# Altium schematic sheet OSPLC2_2_CPU2.SchDoc
size 294 x 198 mm
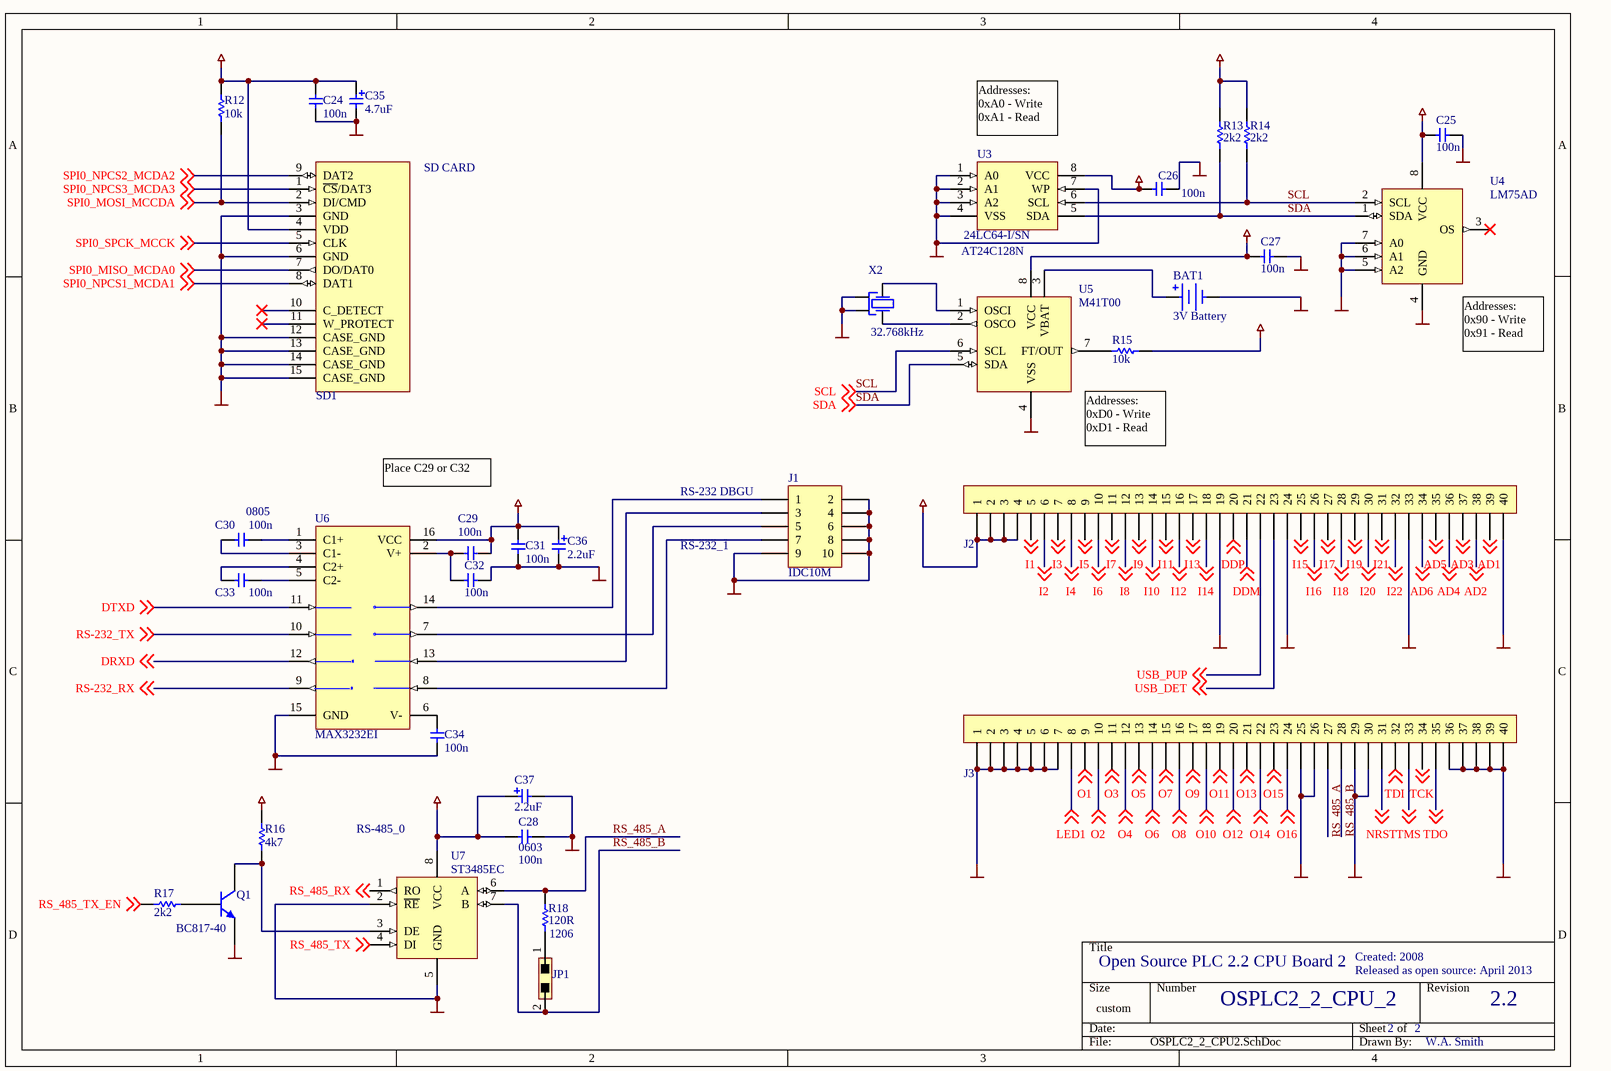
[diagram p0: OSPLC2_2_CPU2.SchDoc]

## Parts
BAT1  3V Battery  [BATTERY_22MM]
C24  value 100n  [0603]  (hidden comment: 0603)
C25  value 100n  [0603]  (hidden comment: 0603)
C26  value 100n  [0603]  (hidden comment: 0603)
C27  value 100n  [0603]  (hidden comment: 0603)
C28  0603  value 100n  [0603]
C29  value 100n  [0805]  (hidden comment: 0805)
C30  0805  value 100n  [0805]
C31  value 100n  [0805]  (hidden comment: 0805)
C32  value 100n  [0805]  (hidden comment: 0805)
C33  value 100n  [0805]  (hidden comment: 0805)
C34  value 100n  [0805]  (hidden comment: 0805)
C35  value 4.7uF  [CAP_TANT_A]  (hidden comment: Tant_A)
C36  value 2.2uF  [CAP_TANT_A]  (hidden comment: Tant_A)
C37  value 2.2uF  [CAP_TANT_A]  (hidden comment: Tant_A)
J1  IDC10M  [IDC_10M_BOX]
J2  HEADER 1 x 40  [HEADER_1_40]  (value not drawn)
J3  HEADER 1 x 40  [HEADER_1_40]  (value not drawn)
JP1  JUMPER2  [JUMPER2_254]  (value not drawn)
Q1  BC817-40  [SO-G3/Y1]
R12  value 10k  [0805]  (hidden comment: 0805)
R13  value 2k2  [0805]  (hidden comment: 0805)
R14  value 2k2  [0805]  (hidden comment: 0805)
R15  value 10k  [0805]  (hidden comment: 0805)
R16  value 4k7  [0805]  (hidden comment: 0805)
R17  value 2k2  [0805]  (hidden comment: 0805)
R18  1206  value 120R  [1206]
SD1  SD Card Connector  [SD_CARD_GS09003P]  (value not drawn)
U3  24LC64-I/SN  value AT24C128N  [SO-G8/Z7.4]
U4  LM75AD  [SO-G8/X.6]
U5  M41T00  [SO-G8/X.6]
U6  MAX3232EI  [SO-G16]
U7  ST3485EC  [SO-G8/Z7.4]
X2  32.768kHz  [SCM200S_SMT]

## Nets
GND: BAT1.2(NEG) C24.1 C25.2 C26.2 C27.2 C28.2 C31.2 C32.1 C34.1 C35.2 C36.2 C37.2 J1.2 J1.4 J1.6 J1.8 J1.9 J1.10 J2.19 J2.24 J2.33 J2.40 J3.1 J3.2 J3.3 J3.4 J3.5 J3.6 J3.7 J3.25 J3.26 J3.29 J3.30 J3.36 J3.37 J3.38 J3.39 J3.40 Q1.2(E) SD1.3(GND) SD1.6(GND) SD1.12(CASE_GND) SD1.13(CASE_GND) SD1.14(CASE_GND) SD1.15(CASE_GND) U3.1(A0) U3.2(A1) U3.3(A2) U3.4(VSS) U3.7(WP) U4.4(GND) U4.5(A2) U4.6(A1) U4.7(A0) U5.4(VSS) U6.15(GND) U7.2(~{RE}) U7.5(GND) X2.2(GND) X2.3(GND)
VCC3v3: C24.2 C25.1 C26.1 C27.1 C28.1 C29.1 C31.1 C35.1 C36.1 C37.1 J2.1 J2.2 J2.3 J2.4 R12.2 R13.2 R14.2 R15.2 R16.2 SD1.4(VDD) U3.8(VCC) U4.8(VCC) U5.8(VCC) U6.16(VCC) U7.8(VCC)
AD1: J2.39 ; off-sheet AD1
AD2: J2.38 ; off-sheet AD2
AD3: J2.37 ; off-sheet AD3
AD4: J2.36 ; off-sheet AD4
AD5: J2.35 ; off-sheet AD5
AD6: J2.34 ; off-sheet AD6
DDM: J2.21 ; off-sheet DDM
DDP: J2.20 ; off-sheet DDP
DRXD: U6.12(R1OUT) ; off-sheet DRXD
DTXD: U6.11(T1IN) ; off-sheet DTXD
I1: J2.5 ; off-sheet I1
I2: J2.6 ; off-sheet I2
I3: J2.7 ; off-sheet I3
I4: J2.8 ; off-sheet I4
I5: J2.9 ; off-sheet I5
I6: J2.10 ; off-sheet I6
I7: J2.11 ; off-sheet I7
I8: J2.12 ; off-sheet I8
I9: J2.13 ; off-sheet I9
I10: J2.14 ; off-sheet I10
I11: J2.15 ; off-sheet I11
I12: J2.16 ; off-sheet I12
I13: J2.17 ; off-sheet I13
I14: J2.18 ; off-sheet I14
I15: J2.25 ; off-sheet I15
I16: J2.26 ; off-sheet I16
I17: J2.27 ; off-sheet I17
I18: J2.28 ; off-sheet I18
I19: J2.29 ; off-sheet I19
I20: J2.30 ; off-sheet I20
I21: J2.31 ; off-sheet I21
I22: J2.32 ; off-sheet I22
LED1: J3.8 ; off-sheet LED1
NRST: J3.31 ; off-sheet NRST
O1: J3.9 ; off-sheet O1
O2: J3.10 ; off-sheet O2
O3: J3.11 ; off-sheet O3
O4: J3.12 ; off-sheet O4
O5: J3.13 ; off-sheet O5
O6: J3.14 ; off-sheet O6
O7: J3.15 ; off-sheet O7
O8: J3.16 ; off-sheet O8
O9: J3.17 ; off-sheet O9
O10: J3.18 ; off-sheet O10
O11: J3.19 ; off-sheet O11
O12: J3.20 ; off-sheet O12
O13: J3.21 ; off-sheet O13
O14: J3.22 ; off-sheet O14
O15: J3.23 ; off-sheet O15
O16: J3.24 ; off-sheet O16
RS-232_RX: U6.9(R2OUT) ; off-sheet RS-232_RX
RS-232_TX: U6.10(T2IN) ; off-sheet RS-232_TX
RS_485_A: J3.27 R18.2 U7.6(A)
RS_485_B: J3.28 JP1.2 U7.7(B)
RS_485_RX: U7.1(RO) ; off-sheet RS_485_RX
RS_485_TX: U7.4(DI) ; off-sheet RS_485_TX
RS_485_TX_EN: R17.2 ; off-sheet RS_485_TX_EN
SCL: R14.1 U3.6(SCL) U4.2(SCL) U5.6(SCL) ; off-sheet SCL
SDA: R13.1 U3.5(SDA) U4.1(SDA) U5.5(SDA) ; off-sheet SDA
SPI0_MISO_MCDA0: SD1.7(DO/DAT0) ; off-sheet SPI0_MISO_MCDA0
SPI0_MOSI_MCCDA: R12.1 SD1.2(DI/CMD) ; off-sheet SPI0_MOSI_MCCDA
SPI0_NPCS1_MCDA1: SD1.8(DAT1) ; off-sheet SPI0_NPCS1_MCDA1
SPI0_NPCS2_MCDA2: SD1.9(DAT2) ; off-sheet SPI0_NPCS2_MCDA2
SPI0_NPCS3_MCDA3: SD1.1(~{CS}/DAT3) ; off-sheet SPI0_NPCS3_MCDA3
SPI0_SPCK_MCCK: SD1.5(CLK) ; off-sheet SPI0_SPCK_MCCK
TCK: J3.34 ; off-sheet TCK
TDI: J3.32 ; off-sheet TDI
TDO: J3.35 ; off-sheet TDO
TMS: J3.33 ; off-sheet TMS
USB_DET: J2.23 ; off-sheet USB_DET
USB_PUP: J2.22 ; off-sheet USB_PUP
NetBAT1_1: BAT1.1(POS) U5.3(VBAT)
NetC29_2: C29.2 C32.2 U6.2(V+)
NetC30_1: C30.1 U6.1(C1+)
NetC30_2: C30.2 U6.3(C1-)
NetC33_1: C33.1 U6.5(C2-)
NetC33_2: C33.2 U6.4(C2+)
NetC34_2: C34.2 U6.6(V-)
NetJ1_1: J1.1 U6.14(T1OUT)
NetJ1_3: J1.3 U6.13(R1IN)
NetJ1_5: J1.5 U6.7(T2OUT)
NetJ1_7: J1.7 U6.8(R2IN)
NetJP1_1: JP1.1 R18.1
NetQ1_1: Q1.1(B) R17.1
NetQ1_3: Q1.3(C) R16.1 U7.3(DE)
NetR15_1: R15.1 U5.7(FT/OUT)
NetU5_1: U5.1(OSCI) X2.1(X)
NetU5_2: U5.2(OSCO) X2.4(X)

Not connected (* = marked no-connect by the designer): SD1 10(C_DETECT)* 11(W_PROTECT)*; U4 3(OS)*

## Notes on the sheet
- (near U3) Addresses:
  0xA0 - Write
  0xA1 - Read
- SD CARD
- (near U4) Addresses:
  0x90 - Write
  0x91 - Read
- Place C29 or C32
- (near U5) Addresses:
  0xD0 - Write
  0xD1 - Read
- (near J1) RS-232 DBGU
- RS-232_1
- (near U7) RS-485_0
- Created: 2008
- Open Source PLC 2.2 CPU Board 2
- OSPLC2_2_CPU_2
- Released as open source: April 2013
- 2.2
- 2
- W.A. Smith

## Library data of the parts
BAT1 = BATTERY_22MM: 3 Volt Lithium Button Battery
C24-C28 = CAP_0603: 0603 footprint non-polorised capacitor
C29-C34 = CAP_0805: 0805 footprint non-polarised capacitor
C35-C37 = CAP_TANT_A: Tantalum Capacitor, A Package
J1 = IDC_10M: 10 pin IDC male connector, vertical, box
J2 J3 = HEADER_1_40: 2.54mm header, 1 by 40; Value: HEADER_1_40_2.54
JP1 = JUMPER2: 2 Pin Jumper, 2.54mm
Q1 = BC817-40: NPN General Purpose Amplifier; Manufacturer: Fairchild Semiconductor; Revision 1: 11-July-2000: SIM Model Added.; Revision 2: July-2002: Re-released for DXP Platform.; Package Information: Latest Revision: Sep-1998; Class I: Discrete; Class II: BJT - Low Power; Published: 8-Jun-2000; Datasheet: Latest Revision: 1997; Package Reference: SOT-23A; Publisher: Altium Limited; Value: BC817-40
R12-R17 = RES_0805: 0805 footprint resistor
R18 = RES_1206: 1206 footprint resistor
SD1 = SD_CARD_GSD09003P: Secure Digital Card Connector, Amphenol, GSD09003P; Value: SD_CARD_HOLDER
U3 = 24LC64-I/SN: Microchip 64k bit I2C bus serial EEPROM
U4 = LM75AD: Phillips Digital temperature sensor and thermal Watchdog
U5 = M41T00: ST Serial Access Timekeeper; Value: M41T00
U6 = MAX3232ESE: 3.0V TO 5.5V, Low-Power, up to 1Mbps, True RS-232 Transceiver Using Four 0.1µF External Capacitor; Manufacturer: Maxim; Class I: Communication; Published: 16-Jan-2001; Revision: July-2002: Re-released for DXP Platform.; Datasheet: Latest Revision: Mar-1999; Package Reference: NSO16; Publisher: Altium Limited; Class II: Transceiver; Value: MAX3232EI
U7 = ST3485EC: ST 3.3v RS-485/RS-422 Transceiver; Value: ST3485EC
X2 = SCM200S: SMT 32.768kHz Crystal; Value: SCM200S-32.768kHz